# EAGLE design wifiserial (EAGLE 6.6.0)
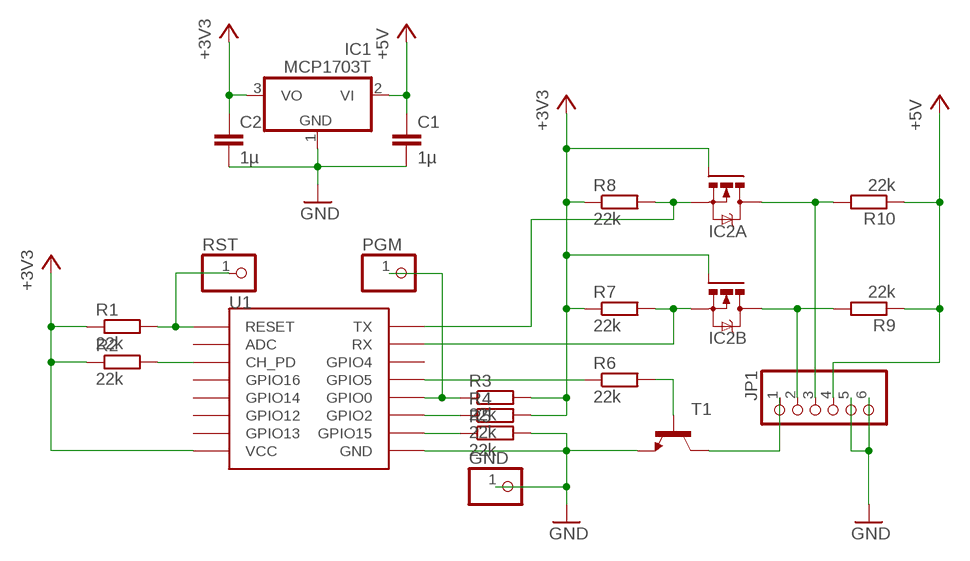
[diagram p0: schematic, sheet 1]

## Parts
C1  1µ  C-EUC0805K  [C0805K]
C2  1µ  C-EUC0805K  [C0805K]
GND  PINHD-1X1  [1X01]
IC1  MCP1703T  VREG-SOT89  [SOT-89]
IC2  NFET2-SSOT6  [SSOT-6]
JP1  PINHD-1X6  [1X06]
PGM  PINHD-1X1  [1X01]
R1  22k  R-EU_R0805  [R0805]
R2  22k  R-EU_R0805  [R0805]
R3  22k  R-EU_R0805  [R0805]
R4  22k  R-EU_R0805  [R0805]
R5  22k  R-EU_R0805  [R0805]
R6  22k  R-EU_R0805  [R0805]
R7  22k  R-EU_R0805  [R0805]
R8  22k  R-EU_R0805  [R0805]
R9  22k  R-EU_R0805  [R0805]
R10  22k  R-EU_R0805  [R0805]
RST  PINHD-1X1  [1X01]
T1  -NPN-SOT23-EBC  [SOT23-EBC]
U1  ESP12SMD  [ESP12-SMD]

## Nets
+3V3: C2.1 IC1.3(VO) IC2.1(A:G) IC2.3(B:G) R1.1 R2.1 R3.2 R4.2 R7.1 R8.1 U1.VCC
+5V: C1.1 IC1.2(VI) JP1.4 R9.1 R10.1
GND: C1.2 C2.2 GND.1 IC1.1(GND) JP1.5 JP1.6 R5.2 T1.E U1.GND
N$1: PGM.1 R3.1 U1.GPIO0
N$2: R4.1 U1.GPIO2
N$3: R5.1 U1.GPIO15
N$4: R2.2 U1.CH_PD
N$5: R1.2 RST.1 U1.RESET
N$6: R6.1 U1.GPIO5
N$7: R6.2 T1.B
N$8: IC2.4(B:D) JP1.2 R9.2
N$9: IC2.6(A:D) JP1.3 R10.2
N$11: JP1.1 T1.C
N$12: IC2.5(A:S) R8.2 U1.TXD0(TX)
N$13: IC2.2(B:S) R7.2 U1.RXD0(RX)
Unconnected: U1.ADC U1.GPIO4 U1.GPIO12 U1.GPIO13 U1.GPIO14 U1.GPIO16

## Library data of the parts
C1 C2 = resistor:C-EU: CAPACITOR, European symbol
GND PGM RST = pinhead:PINHD-1X1: PIN HEADER
IC1 = frell-misc:VREG-SOT89
IC2 = frell-misc:NFET2-SSOT6
JP1 = pinhead:PINHD-1X6: PIN HEADER
R1-R10 = resistor:R-EU_: RESISTOR, European symbol
T1 = transistor:*-NPN-: NPN Transistror BF959 corrected 2008.03.06
U1 = esp8266modules:ESP12: ESP8266 Wifi module 12

## Board
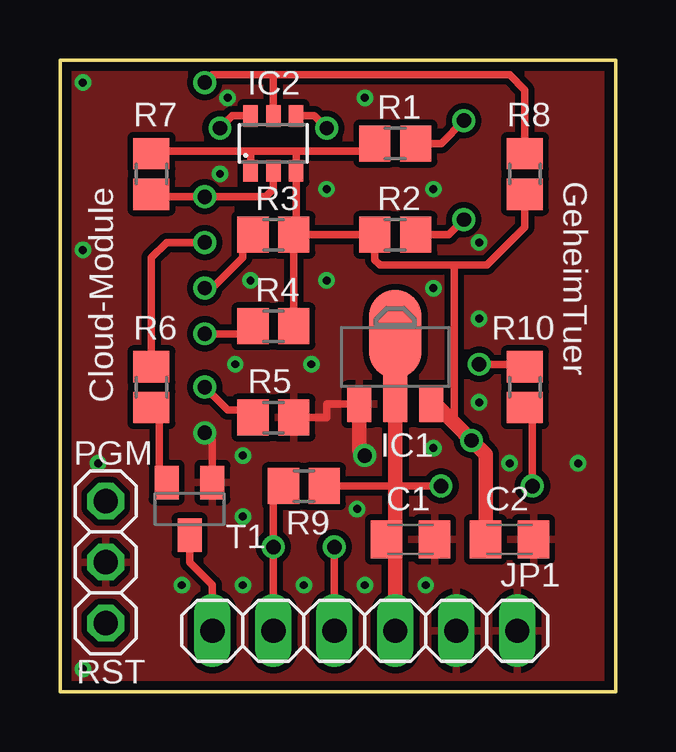
[diagram p1: board, top side]
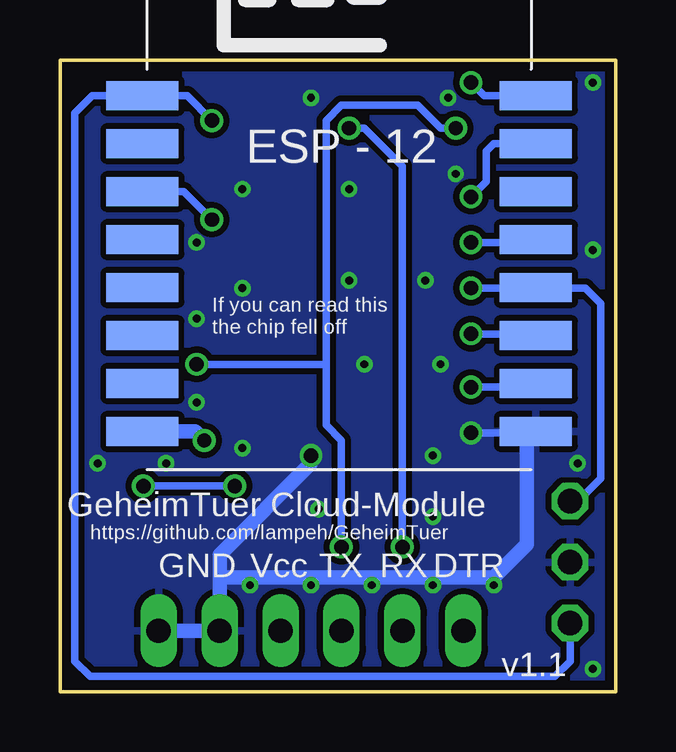
[diagram p2: board, bottom side, seen from below]

Size 23.16 x 26.34 mm. Coordinates in mm from the lower left corner, seen from the top.
Outline: 0,0 23.16,0 23.16,26.34 0,26.34 0,0
Copper layers (1*16): Top 0.0356mm / dielectric 1.5011mm / Bottom 0.0356mm
Design rules "oshpark-2layer *": minimum track width 6mil, minimum drill 13mil, track to track 6mil, track to pad 6mil, pad to pad 6mil, via to via 6mil, smd to smd 6mil, copper to edge 15mil, drill to drill 6mil, minimum pad ring 7mil, minimum via ring 7mil, stop-mask expansion 2.5mil, vias tented up to drill 125mil, thermal gap 10mil

### Footprints (pad centres in the part's own frame; a part is rotated, then mirrored left to right if it is on the bottom)
C0805K = smd 1.3 x 1.6: 1 -1,0; 2 1,0
1X01 = drill 1.016 octagon: 1 0,0
SOT-89 = smd 1 x 1.5: 1 -1.499,-1.981; 3 1.499,-1.981 | smd 1 x 2: 2 0,-1.727 | smd 2.2 x 3.7: 2@1 0,0.94
SSOT-6 = smd 0.6 x 0.9: 1 -0.95,-1.15; 2 0,-1.15; 3 0.95,-1.15; 4 0.95,1.15; 5 0,1.15; 6 -0.95,1.15
1X06 = drill 1.016 long: 1 -6.35,0; 2 -3.81,0; 3 -1.27,0; 4 1.27,0; 5 3.81,0; 6 6.35,0
R0805 = smd 1.3 x 1.5: 1 -0.85,0; 2 0.85,0
SOT23-EBC = smd 1 x 1.4: B 0.95,-1.1; C 0,1.1; E -0.95,-1.1
ESP12-SMD = smd 3 x 1.2: ADC -8.3,3.8; CH_PD -8.3,1.8; GND 8.1,-8.2; GPIO0 8.1,-2.2; GPIO2 8.1,-4.2; GPIO4 8.1,1.8; GPIO5 8.1,-0.2; GPIO12 -8.3,-4.2; GPIO13 -8.3,-6.2; GPIO14 -8.3,-2.2; GPIO15 8.1,-6.2; GPIO16 -8.3,-0.2; RESET -8.3,5.8; RXD0 8.1,3.8; TXD0 8.1,5.8; VCC -8.3,-8.2

### Placement (x,y rotation side)
C1  14.61,6.35 0 top
C2  18.73,6.35 0 top
GND  1.91,5.4 0 top
IC1  13.97,13.97 0 top
IC2  8.89,22.86 0 top
JP1  12.7,2.54 0 top
PGM  1.91,7.94 0 top
R1  13.97,22.86 0 top
R2  13.97,19.05 0 top
R3  8.89,19.05 0 top
R4  8.89,15.24 0 top
R5  8.89,11.43 0 top
R6  3.81,12.7 270 top
R7  3.81,21.59 270 top
R8  19.37,21.59 90 top
R9  10.16,8.57 180 top
R10  19.37,12.7 90 top
RST  1.91,2.86 0 top
T1  5.4,7.62 180 top
U1  11.43,19.05 0 bottom

### Tracks (layer width: path | path; a pad name or v marks a point on that pad's centre or on a via)
+3V3  (via drill 0.6)
  Top 0.305: R3.2 R2.1 13.12,18 13.34,17.78 16.51,17.78 | IC2.1 7.94,22.54 | 16.51,17.78 17.78,17.78 19.37,19.37 R8.1 | R7.1 3.81,22.54 7.94,22.54 | 16.51,17.78 16.43,17.7 16.43,11.2 16.51,11.11 | R4.2 R3.2 | 7.94,22.54 9.84,22.54 | 9.84,22.54 IC2.3 9.84,19.05 R3.2 | R1.1 13.12,22.54 9.84,22.54
  Top 0.61: C2.1 17.73,9.89 v17.14,10.48 16.51,11.11 15.63,11.99 IC1.3
  Bottom 0.61: v17.14,10.48 17.52,10.85 U1.VCC
+5V  (via drill 0.6)
  Top 0.305: R9.1 13.97,8.57 v15.88,8.57 | R10.1 19.68,11.85 v19.68,8.57
  Top 0.61: IC1.2 13.97,8.57 13.97,6.71 C1.1 | 13.34,6.4 C1.1 | 13.34,6.3 C1.1 | JP1.4 13.97,5.99 C1.1
  Bottom 0.305: v19.68,8.57 v15.88,8.57
GND  (via drill 0.33, 0.6)
  Top 0.305: R5.2 11.11,11.43 11.11,11.99 IC1.1 | T1.E 6.35,10.48 v6.03,10.79
  Top 0.61: IC1.1 12.47,10.07 v12.7,9.84
  Bottom 0.305: 16.51,4.13 JP1.5 | 16.19,4.76 16.51,4.45 | U1.GND 3.7,10.48 4.02,10.79 v6.03,10.79
  Bottom 0.61: JP1.6 JP1.5 16.51,4.45 16.51,5.71 12.7,9.53 v12.7,9.84 | 16.19,4.76 5.08,4.76 3.7,6.14 3.7,10.48
  other vias: 0.95,0.95 11.11,20.95 15.56,20.95 0.95,25.4 10.48,13.65 17.46,15.56 6.67,21.59 15.56,10.16 7.3,13.65 10.16,4.45 12.7,4.45 15.24,4.45 7.62,4.45 6.99,24.77 15.56,16.83 11.11,17.14 17.46,12.06 17.46,18.73 7.94,17.14 12.38,7.62 0.95,18.41 12.7,24.77 1.59,9.53 21.59,9.53 18.73,9.53 7.62,9.84 7.62,7.3 5.08,4.45
  pour Bottom (isolate 0.254): 0,26.35 23.18,26.35 23.18,0 0,0
  pour Top (isolate 0.254): 0,26.35 22.86,26.35 22.86,0 0,0
N$1  (via drill 0.6)
  Top 0.305: 8.04,18.52 8.04,18.73 7.62,18.73 | R3.1 7.94,19.05 7.62,18.73 | 7.62,18.73 7.62,18.1 6.35,16.83 v6.03,16.83
  Bottom 0.305: v6.03,16.83 3.35,16.83 U1.GPIO0 3.31,16.83 1.27,16.83 0.64,16.19 0.64,8.89 1.59,7.94 PGM.1
N$2  (via drill 0.6)
  Top 0.305: v6.03,14.92 7.72,14.92 R4.1
  Bottom 0.305: v6.03,14.92 3.4,14.92 U1.GPIO2
N$3  (via drill 0.6)
  Top 0.305: v6.03,12.7 6.99,11.75 7.72,11.75 R5.1
  Bottom 0.305: v6.03,12.7 3.48,12.7 U1.GPIO15
N$4  (via drill 0.6)
  Top 0.305: R2.2 16.19,19.05 v16.83,19.68
  Bottom 0.305: v16.83,19.68 17.99,20.85 U1.CH_PD
N$5  (via drill 0.6)
  Top 0.305: v16.83,23.81 15.88,22.86 R1.2
  Bottom 0.305: v16.83,23.81 17.86,24.85 U1.RESET 21.82,24.85 22.54,24.13 22.54,1.27 21.91,0.64 2.54,0.64 1.91,1.27 RST.1
N$6  (via drill 0.6)
  Top 0.305: R6.1 3.81,18.1 4.45,18.73 v6.03,18.73
  Bottom 0.305: v6.03,18.73 3.45,18.73 U1.GPIO5
N$7
  Top 0.305: R6.2 4.13,11.85 4.13,8.72 T1.B
N$8  (via drill 0.6)
  Top 0.305: JP1.2 v8.89,6.03 8.89,8.15 R9.2 | IC2.4 10.6,24.01 v11.11,23.5
  Bottom 0.305: v8.89,6.03 8.89,21.91 10.48,23.5 v11.11,23.5
N$9  (via drill 0.6)
  Top 0.305: JP1.3 v11.43,6.03 | v17.46,13.65 19.27,13.65 R10.2 | IC2.6 7.18,24.01 v6.67,23.5
  Bottom 0.305: v6.67,23.5 7.3,23.5 8.26,24.45 11.43,24.45 12.06,23.81 12.06,13.65 | 12.06,13.65 12.06,11.11 11.43,10.48 v11.43,6.03 | v17.46,13.65 12.06,13.65
N$11
  Top 0.305: T1.C 5.4,5.4 6.35,4.45 JP1.1
N$12  (via drill 0.6)
  Top 0.305: R8.2 19.37,25.08 18.73,25.72 8.89,25.72 | 8.89,25.72 6.35,25.72 v6.03,25.4 | IC2.5 8.89,25.72
  Bottom 0.305: v6.03,25.4 5.48,24.85 U1.TXD0
N$13  (via drill 0.6)
  Top 0.305: R7.2 4.03,20.74 4.13,20.64 v6.03,20.64 8.57,20.64 8.89,20.95 IC2.2
  Bottom 0.305: U1.RXD0 5.08,22.86 5.4,22.54 5.4,21.27 v6.03,20.64

### Text on the board
tNames: GeheimTuer | Cloud-Module
bNames: If you can read this / the chip fell off | GeheimTuer Cloud-Module | https://github.com/lampeh/GeheimTuer | DTR | RX | TX | Vcc | GND | v1.1